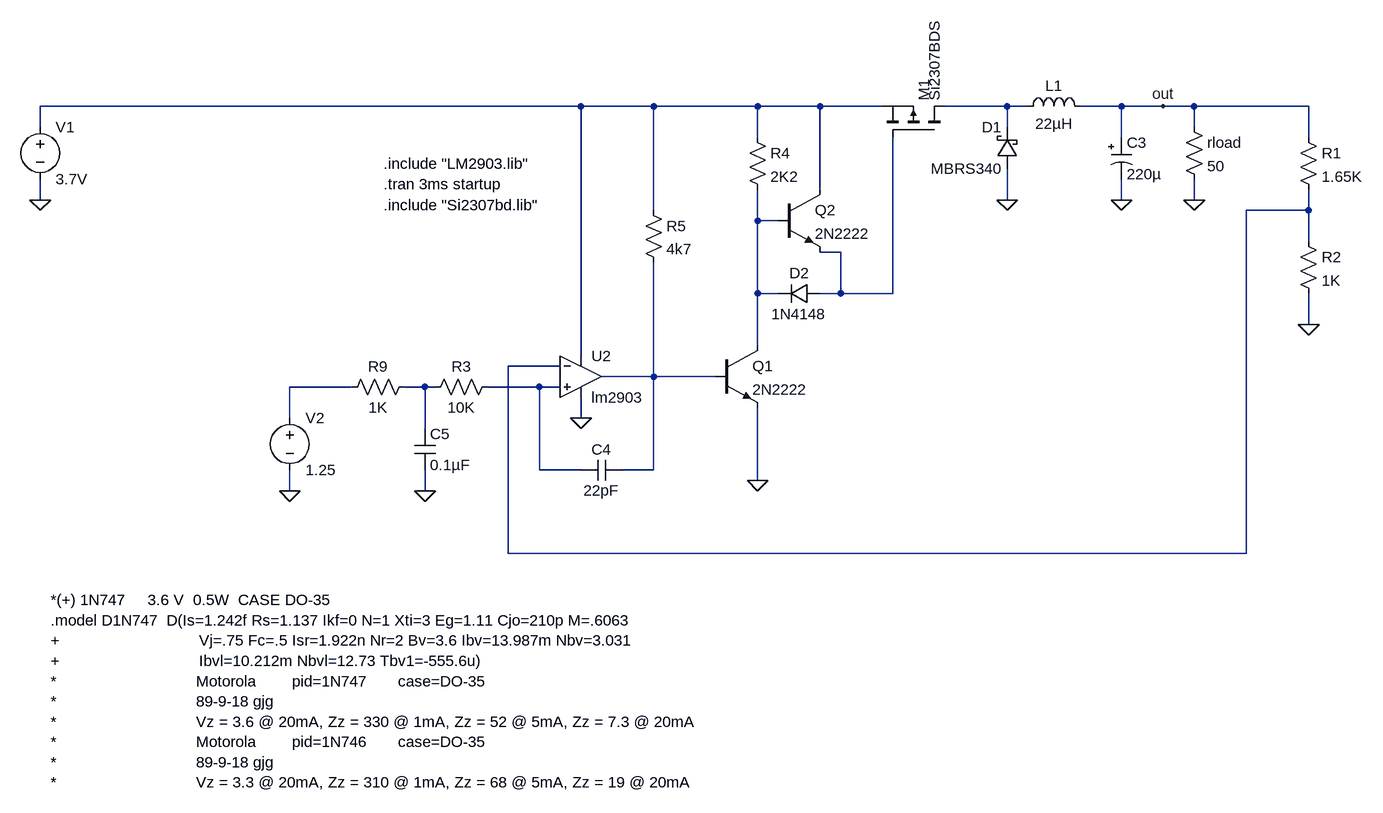
[diagram p0: schematic discrete buck - 3.7V.asc]
discrete buck - 3.7V.asc, the LTspice schematic file:
Version 4
SHEET 1 1820 1540
WIRE -288 384 -1120 384
WIRE -176 384 -288 384
WIRE -16 384 -176 384
WIRE 80 384 -16 384
WIRE 176 384 80 384
WIRE 368 384 272 384
WIRE 400 384 368 384
WIRE 544 384 480 384
WIRE 608 384 544 384
WIRE 656 384 608 384
WIRE 832 384 656 384
WIRE -1120 416 -1120 384
WIRE 368 416 368 384
WIRE 656 416 656 384
WIRE -16 432 -16 384
WIRE 544 432 544 384
WIRE 832 432 832 384
WIRE 80 512 80 384
WIRE -1120 528 -1120 496
WIRE 368 528 368 480
WIRE 544 528 544 496
WIRE 656 528 656 496
WIRE -176 544 -176 384
WIRE 832 544 832 512
WIRE 832 544 736 544
WIRE -16 560 -16 512
WIRE 16 560 -16 560
WIRE 832 592 832 544
WIRE 112 608 80 608
WIRE -16 672 -16 560
WIRE 16 672 -16 672
WIRE 112 672 112 608
WIRE 112 672 80 672
WIRE 192 672 192 432
WIRE 192 672 112 672
WIRE 832 720 832 672
WIRE -16 752 -16 672
WIRE -288 768 -288 384
WIRE -320 784 -400 784
WIRE -176 800 -176 624
WIRE -176 800 -256 800
WIRE -80 800 -176 800
WIRE -640 816 -736 816
WIRE -528 816 -560 816
WIRE -512 816 -528 816
WIRE -352 816 -432 816
WIRE -320 816 -352 816
WIRE -736 864 -736 816
WIRE -288 864 -288 832
WIRE -528 880 -528 816
WIRE -352 944 -352 816
WIRE -288 944 -352 944
WIRE -176 944 -176 800
WIRE -176 944 -224 944
WIRE -16 960 -16 848
WIRE -736 976 -736 944
WIRE -528 976 -528 944
WIRE -400 1072 -400 784
WIRE 736 1072 736 544
WIRE 736 1072 -400 1072
FLAG -1120 528 0
FLAG -288 864 0
FLAG 544 528 0
FLAG -16 960 0
FLAG 656 528 0
FLAG -528 976 0
FLAG 368 528 0
FLAG 608 384 out
FLAG -736 976 0
FLAG 832 720 0
SYMBOL voltage -1120 400 R0
WINDOW 123 0 0 Left 2
WINDOW 39 0 0 Left 2
SYMATTR InstName V1
SYMATTR Value 3.7V
SYMBOL Opamps\\opamp2 -288 736 R0
SYMATTR InstName U2
SYMATTR Value lm2903
SYMBOL schottky 384 480 R180
WINDOW 0 24 64 Left 2
WINDOW 3 24 0 Left 2
SYMATTR InstName D1
SYMATTR Value MBRS340
SYMATTR Description Diode
SYMATTR Type diode
SYMBOL polcap 528 432 R0
WINDOW 3 24 56 Left 2
SYMATTR Value 220µ
SYMATTR InstName C3
SYMATTR Description Capacitor
SYMATTR Type cap
SYMATTR SpiceLine V=25 Irms=555m Rser=0.13 Lser=0 mfg="United Chemi-Con" pn="LXF25VB221M8X15LL" type="Al electrolytic"
SYMBOL ind 384 400 R270
WINDOW 0 32 56 VTop 2
WINDOW 3 5 56 VBottom 2
SYMATTR InstName L1
SYMATTR Value 22µH
SYMATTR SpiceLine Ipk=2.3 Rser=0.07 Rpar=0 Cpar=0
SYMBOL pmos 272 432 M270
WINDOW 3 56 16 Left 2
SYMATTR Value Si2307BDS
SYMATTR InstName M1
SYMATTR Prefix X
SYMBOL npn3 -80 752 R0
SYMATTR InstName Q1
SYMATTR Value 2N2222
SYMBOL npn3 16 512 R0
SYMATTR InstName Q2
SYMATTR Value 2N2222
SYMBOL diode 80 656 R90
WINDOW 0 0 32 VBottom 2
WINDOW 3 32 32 VTop 2
SYMATTR InstName D2
SYMATTR Value 1N4148
SYMBOL res -32 416 R0
SYMATTR InstName R4
SYMATTR Value 2K2
SYMBOL res -192 528 R0
SYMATTR InstName R5
SYMATTR Value 4k7
SYMBOL cap -224 928 R90
WINDOW 0 0 32 VBottom 2
WINDOW 3 32 32 VTop 2
SYMATTR InstName C4
SYMATTR Value 22pF
SYMBOL res -416 800 R90
WINDOW 0 0 56 VBottom 2
WINDOW 3 32 56 VTop 2
SYMATTR InstName R3
SYMATTR Value 10K
SYMBOL res -544 800 R90
WINDOW 0 0 56 VBottom 2
WINDOW 3 32 56 VTop 2
SYMATTR InstName R9
SYMATTR Value 1K
SYMBOL cap -544 880 R0
SYMATTR InstName C5
SYMATTR Value 0.1µF
SYMBOL res 640 400 R0
SYMATTR InstName rload
SYMATTR Value 50
SYMBOL voltage -736 848 R0
WINDOW 123 0 0 Left 2
WINDOW 39 0 0 Left 2
SYMATTR InstName V2
SYMATTR Value 1.25
SYMBOL res 816 416 R0
SYMATTR InstName R1
SYMATTR Value 1.65K
SYMBOL res 816 576 R0
SYMATTR InstName R2
SYMATTR Value 1K
TEXT -592 504 Left 2 !.tran 3ms startup
TEXT -592 536 Left 2 !.include "Si2307bd.lib"
TEXT -592 472 Left 2 !.include "LM2903.lib"
TEXT -1104 1144 Left 2 !*(+) 1N747     3.6 V  0.5W  CASE DO-35\n.model D1N747  D(Is=1.242f Rs=1.137 Ikf=0 N=1 Xti=3 Eg=1.11 Cjo=210p M=.6063\n+                               Vj=.75 Fc=.5 Isr=1.922n Nr=2 Bv=3.6 Ibv=13.987m Nbv=3.031\n+                               Ibvl=10.212m Nbvl=12.73 Tbv1=-555.6u)\n*                               Motorola        pid=1N747       case=DO-35\n*                               89-9-18 gjg\n*                               Vz = 3.6 @ 20mA, Zz = 330 @ 1mA, Zz = 52 @ 5mA, Zz = 7.3 @ 20mA\n*                               Motorola        pid=1N746       case=DO-35\n*                               89-9-18 gjg\n*                               Vz = 3.3 @ 20mA, Zz = 310 @ 1mA, Zz = 68 @ 5mA, Zz = 19 @ 20mA

The netlist it stands for:
* discrete buck - 3.7V.asc
V1 N001 0 3.7V
XU2 N009 N003 N001 0 N006 lm2903  ; pins In+ In- V+ V- OUT
D1 0 N002 MBRS340
C3 out 0 220µ V=25 Irms=555m Rser=0.13 Lser=0 mfg="United Chemi-Con" pn="LXF25VB221M8X15LL" type="Al electrolytic"
L1 N002 out 22µH Ipk=2.3 Rser=0.07 Rpar=0 Cpar=0
XM1 N002 N005 N001 Si2307BDS  ; pins D G S
Q1 N004 N006 0 0 2N2222
Q2 N001 N004 N005 0 2N2222
D2 N005 N004 1N4148
R4 N001 N004 2K2
R5 N001 N006 4k7
C4 N006 N009 22pF
R3 N009 N008 10K
R9 N008 N007 1K
C5 N008 0 0.1µF
rload out 0 50
V2 N007 0 1.25
R1 out N003 1.65K
R2 N003 0 1K
.model D D
.lib standard.dio
.model NPN NPN
.model PNP PNP
.lib standard.bjt
.tran 3ms startup
.include "Si2307bd.lib"
.include "LM2903.lib"
*(+) 1N747     3.6 V  0.5W  CASE DO-35
.model D1N747  D(Is=1.242f Rs=1.137 Ikf=0 N=1 Xti=3 Eg=1.11 Cjo=210p M=.6063
+                               Vj=.75 Fc=.5 Isr=1.922n Nr=2 Bv=3.6 Ibv=13.987m Nbv=3.031
+                               Ibvl=10.212m Nbvl=12.73 Tbv1=-555.6u)
*                               Motorola        pid=1N747       case=DO-35
*                               89-9-18 gjg
*                               Vz = 3.6 @ 20mA, Zz = 330 @ 1mA, Zz = 52 @ 5mA, Zz = 7.3 @ 20mA
*                               Motorola        pid=1N746       case=DO-35
*                               89-9-18 gjg
*                               Vz = 3.3 @ 20mA, Zz = 310 @ 1mA, Zz = 68 @ 5mA, Zz = 19 @ 20mA
.backanno
.end